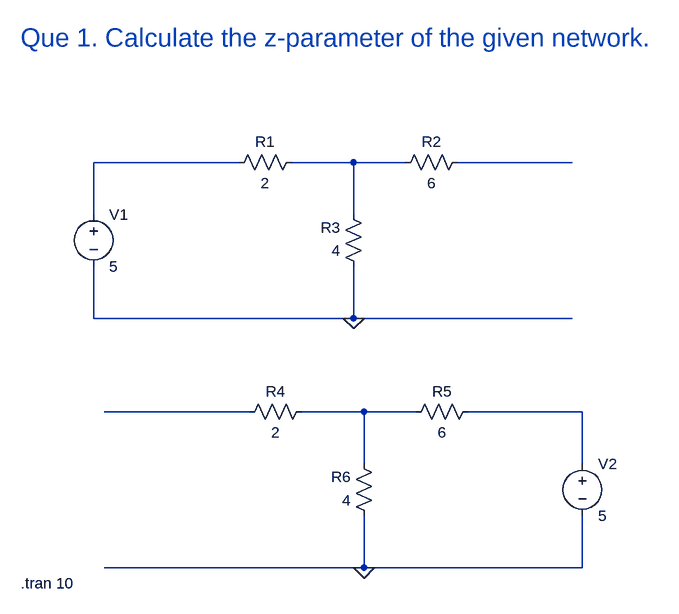
[diagram p0: schematic 1_Dheerendra_23EE019_Two_Port.asc]
1_Dheerendra_23EE019_Two_Port.asc, the LTspice schematic file:
Version 4
SHEET 1 1012 760
WIRE 80 96 -144 96
WIRE 256 96 160 96
WIRE 336 96 256 96
WIRE 592 96 416 96
WIRE -144 176 -144 96
WIRE 256 176 256 96
WIRE -144 336 -144 256
WIRE 256 336 256 256
WIRE 256 336 -144 336
WIRE 592 336 256 336
WIRE 96 480 -128 480
WIRE 272 480 176 480
WIRE 352 480 272 480
WIRE 608 480 432 480
WIRE 272 560 272 480
WIRE 608 560 608 480
WIRE 272 720 272 640
WIRE 272 720 -128 720
WIRE 608 720 608 640
WIRE 608 720 272 720
FLAG 256 336 0
FLAG 272 720 0
SYMBOL res 176 80 R90
WINDOW 0 0 56 VBottom 2
WINDOW 3 32 56 VTop 2
SYMATTR InstName R1
SYMATTR Value 2
SYMBOL res 432 80 R90
WINDOW 0 0 56 VBottom 2
WINDOW 3 32 56 VTop 2
SYMATTR InstName R2
SYMATTR Value 6
SYMBOL res 272 272 R180
WINDOW 0 36 76 Left 2
WINDOW 3 36 40 Left 2
SYMATTR InstName R3
SYMATTR Value 4
SYMBOL voltage -144 160 R0
WINDOW 123 0 0 Left 0
WINDOW 39 0 0 Left 0
SYMATTR InstName V1
SYMATTR Value 5
SYMBOL res 192 464 R90
WINDOW 0 0 56 VBottom 2
WINDOW 3 32 56 VTop 2
SYMATTR InstName R4
SYMATTR Value 2
SYMBOL res 448 464 R90
WINDOW 0 0 56 VBottom 2
WINDOW 3 32 56 VTop 2
SYMATTR InstName R5
SYMATTR Value 6
SYMBOL res 288 656 R180
WINDOW 0 36 76 Left 2
WINDOW 3 36 40 Left 2
SYMATTR InstName R6
SYMATTR Value 4
SYMBOL voltage 608 544 R0
WINDOW 123 0 0 Left 0
WINDOW 39 0 0 Left 0
SYMATTR InstName V2
SYMATTR Value 5
TEXT -256 -96 Left 4 ;Que 1. Calculate the z-parameter of the given network.
TEXT -256 744 Left 2 !.tran 10

The netlist it stands for:
* 1_Dheerendra_23EE019_Two_Port.asc
R1 N002 N001 2
R2 N003 N002 6
R3 0 N002 4
V1 N001 0 5
R4 N005 N004 2
R5 N006 N005 6
R6 0 N005 4
V2 N006 0 5
* Que 1. Calculate the z-parameter of the given network.
.tran 10
.backanno
.end